# EAGLE design tiny45-button-2-leds-FTDI (EAGLE 9.3.0)
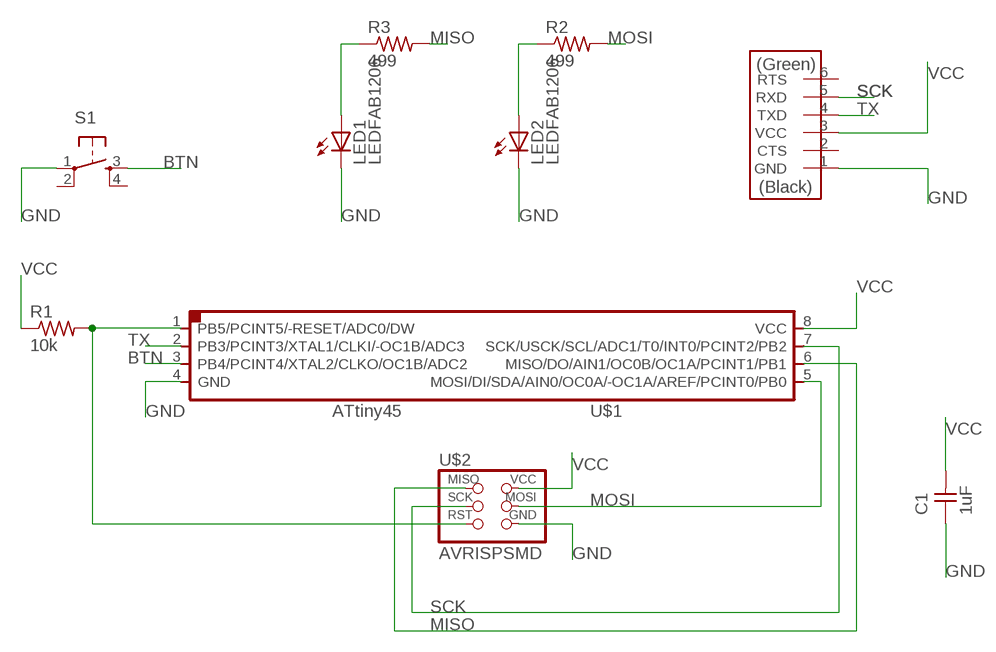
[diagram p0: schematic, sheet 1]

## Parts
C1  1uF  CAP-UNPOLARIZEDFAB  [C1206FAB]
LED1  LEDFAB1206  [LED1206FAB]
LED2  LEDFAB1206  [LED1206FAB]
R1  10k  RES-US1206FAB  [R1206FAB]
R2  499  RES-US1206FAB  [R1206FAB]
R3  499  RES-US1206FAB  [R1206FAB]
S1  6MM_SWITCH6MM_SWITCH  [6MM_SWITCH]
U$1  ATTINY45SI  [SOIC8]
U$2  AVRISPSMD  [2X03SMD]
U$3  FTDI-SMD-HEADER  [1X06SMD]

## Nets
BTN: S1.3(S) U$1.3(PB4/PCINT4/XTAL2/CLKO/OC1B/ADC2)
GND: C1.1 LED1.2(C) LED2.2(C) S1.1(P) U$1.4(GND) U$2.6(GND) U$3.1(GND)
MISO: R3.2 U$1.6(MISO/DO/AIN1/OC0B/OC1A/PCINT1/PB1) U$2.1(MISO)
MOSI: R2.2 U$1.5(MOSI/DI/SDA/AIN0/OC0A/-OC1A/AREF/PCINT0/PB0) U$2.4(MOSI)
N$1: LED1.1(A) R3.1
N$4: LED2.1(A) R2.1
N$8: R1.2 U$1.1(PB5/PCINT5/-RESET/ADC0/DW) U$2.5(RST)
SCK: U$1.7(SCK/USCK/SCL/ADC1/T0/INT0/PCINT2/PB2) U$2.3(SCK) U$3.5(RXD)
TX: U$1.2(PB3/PCINT3/XTAL1/CLKI/-OC1B/ADC3) U$3.4(TXD)
VCC: C1.2 R1.1 U$1.8(VCC) U$2.2(VCC) U$3.3(VCC)
Unconnected: S1.2(P1) S1.4(S1) U$3.2(CTS) U$3.6(RTS)

## Library data of the parts
C1 = fab:CAP-UNPOLARIZED
LED1 LED2 = fab:LED: LED
R1-R3 = fab:RES-US: Resistor (US Symbol) Variants with postfix FAB are widened to allow the routing of internal traces
S1 = fab:6MM_SWITCH: OMRON SWITCH
U$1 = fab:ATTINY45
U$2 = fab:AVRISP
U$3 = fab:FTDI-SMD-HEADER

## Board
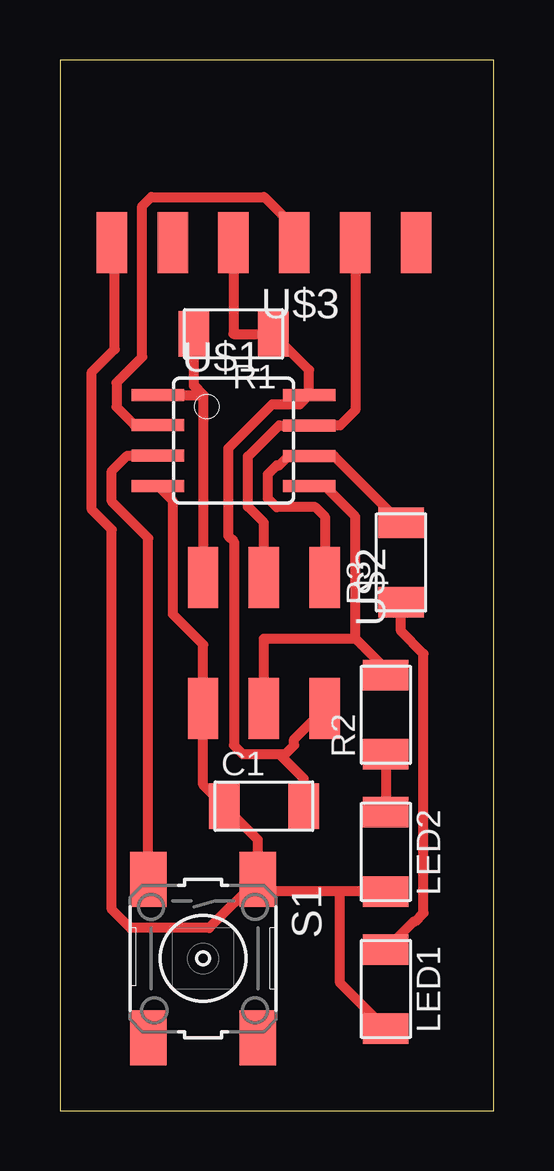
[diagram p1: board, top side]

Size 18.09 x 43.8 mm. Coordinates in mm from the lower left corner, seen from the top.
Outline: 0,0 18.09,0 18.09,43.8 0,43.8 0,0
Copper layers (1*16): Top 0.035mm / dielectric 1.5mm / Bottom 0.035mm
Design rules "fabmodule": minimum track width 10mil, minimum drill 0.4mm, track to track 0.42mm, track to pad 0.42mm, pad to pad 0.42mm, via to via 0.42mm, smd to smd 0.42mm, copper to edge 40mil, drill to drill 0.8mm, minimum pad ring 10mil, minimum via ring 8mil, stop-mask expansion 4mil, vias tented up to drill 0mil, thermal gap 10mil

### Footprints (pad centres in the part's own frame; a part is rotated, then mirrored left to right if it is on the bottom)
C1206FAB = smd 1.27 x 1.905: 1 -1.651,0; 2 1.651,0
LED1206FAB = smd 1.27 x 1.905: 1 -1.651,0; 2 1.651,0
R1206FAB = smd 1.27 x 1.905: 1 -1.651,0; 2 1.651,0
6MM_SWITCH = smd 2.286 x 1.524: 1 -3.302,2.286; 2 3.302,2.286; 3 -3.302,-2.286; 4 3.302,-2.286
SOIC8 = smd 0.5 x 2.2: 1 -1.905,-3.154; 2 -0.645,-3.154; 3 0.625,-3.154; 4 1.895,-3.154; 5 1.905,3.154; 6 0.635,3.154; 7 -0.635,3.154; 8 -1.905,3.154
2X03SMD = smd 2.54 x 1.27: 1 -2.54,2.54; 2 2.92,2.54; 3 -2.54,0; 4 2.92,0; 5 -2.54,-2.54; 6 2.92,-2.54
1X06SMD = smd 2.54 x 1.27: 1 0,6.35; 2 0,3.81; 3 0,1.27; 4 0,-1.27; 5 0,-3.81; 6 0,-6.35

### Placement (x,y rotation side)
C1  8.51,12.7 0 top
LED1  13.59,5.08 270 top
LED2  13.59,10.79 270 top
R1  7.24,32.38 180 top
R2  13.59,16.51 90 top
R3  14.22,22.86 90 top
S1  5.97,6.35 270 top
U$1  7.24,27.94 270 top
U$2  8.51,19.68 270 top
U$3  8.51,36.2 90 top

### Tracks (layer width: path | path; a pad name or v marks a point on that pad's centre or on a via)
BTN
  Top 0.406: S1.3 3.68,23.88 2.16,25.4 2.16,26.67 2.8,27.32 U$1.3
GND
  Top 0.406: U$1.4 4.71,25.42 4.71,20.7 5.97,19.44 U$2.6 5.97,13.59 C1.1 8.26,11.3 S1.1 | LED2.2 11.68,9.14 | 11.68,9.14 8.76,9.14 S1.1 | LED1.2 11.68,5.33 11.68,9.14 | S1.1 6.22,7.62 2.93,7.62 2.16,8.39 2.16,24.23 1.33,25.06 1.33,30.8 2.29,31.75 2.29,36.07 U$3.1
MISO
  Top 0.406: R3.2 11.43,27.3 U$1.6 9.54,27.3 9.14,26.91 9.04,26.91 8.67,26.54 8.67,25.53 9.04,25.16 10.65,25.16 11.05,24.77 U$2.1
MOSI
  Top 0.406: U$2.4 8.51,19.68 12.32,19.68 | 12.32,19.68 12.32,24.77 11.05,26.04 U$1.5 | 12.32,19.68 13.59,18.41 R2.2
N$1
  Top 0.406: R3.1 14.22,20 15.16,19.05 15.16,8.25 14.8,7.89 14.74,7.89 LED1.1
N$4
  Top 0.406: R2.1 LED2.1
N$8
  Top 0.406: U$1.1 5.97,29.84 | 5.97,29.84 5.59,30.23 R1.2 | 5.97,29.84 U$2.5
SCK
  Top 0.406: U$2.3 8.51,24.52 7.84,25.18 7.84,27.27 9.14,28.57 U$1.7 11.68,28.57 12.32,29.21 U$3.5
TX
  Top 0.406: U$3.4 9.78,36.83 8.51,38.1 8.5,38.09 3.81,38.09 3.43,37.71 3.43,31.42 2.36,30.35 2.36,29.34 3.11,28.59 U$1.2
VCC
  Top 0.406: 9.14,14.87 7.62,14.87 7.25,15.24 7.25,23.73 7.02,23.96 7.02,27.62 8.85,29.45 10,29.45 U$1.8 10.39,30.88 R1.1 7.24,32.38 U$3.3 | 9.14,14.87 9.4,14.87 9.77,15.24 9.77,15.48 U$2.2 | C1.2 10.16,13.86 9.14,14.87